# EAGLE design LightingUPS (EAGLE 7.5.0)
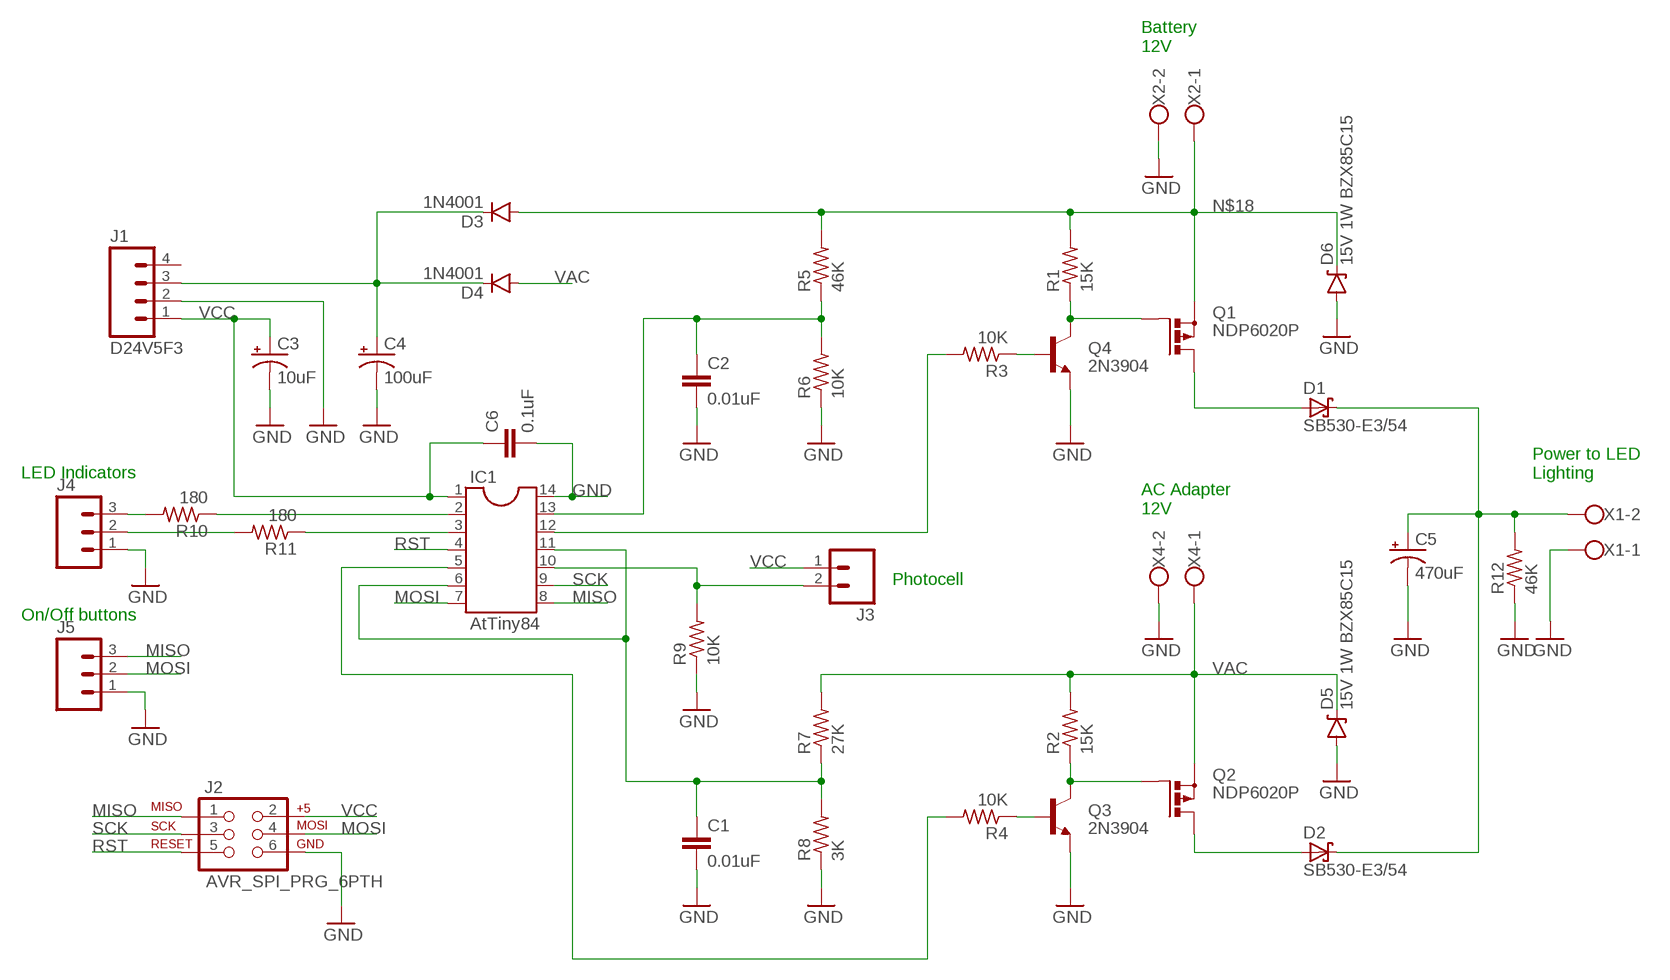
[diagram p0: schematic, sheet 1]

## Parts
C1  0.01uF  CAPPTH1  [CAP-PTH-5MM]
C2  0.01uF  CAPPTH1  [CAP-PTH-5MM]
C3  10uF  CAP_POLPTH1  [CPOL-RADIAL-100UF-25V]
C4  100uF  CAP_POLPTH1  [CPOL-RADIAL-100UF-25V]
C5  470uF  CAP_POLPTH4  [CPOL-RADIAL-1000UF-25V]
C6  0.1uF  CAPPTH  [CAP-PTH-SMALL]
D1  SB530-E3/54  SCHOTTKY-DIODEDO201T15  [DO201T15]
D2  SB530-E3/54  SCHOTTKY-DIODEDO201T15  [DO201T15]
D3  1N4001  DIODEPTH  [DIODE-1N4001]
D4  1N4001  DIODEPTH  [DIODE-1N4001]
D5  15V 1W BZX85C15  DIODE-ZENERPTH  [DIODE-ZENER]
D6  15V 1W BZX85C15  DIODE-ZENERPTH  [DIODE-ZENER]
IC1  AtTiny84  DIL14  [DIL14]
J1  D24V5F3  M04PTH  [1X04]
J2  AVR_SPI_PRG_6PTH  [2X3]
J3  M02PTH  [1X02]
J4  M03PTH  [1X03]
J5  M03PTH  [1X03]
Q1  NDP6020P  PMOSFET_PTO220BV  [TO220BV]
Q2  NDP6020P  PMOSFET_PTO220BV  [TO220BV]
Q3  2N3904  TRANSISTOR_NPNTO-92-AMMO  [TO-92-AMMO]
Q4  2N3904  TRANSISTOR_NPNTO-92-AMMO  [TO-92-AMMO]
R1  15K  R-US_0204/5  [0204/5]
R2  15K  R-US_0204/5  [0204/5]
R3  10K  R-US_0204/5  [0204/5]
R4  10K  R-US_0204/5  [0204/5]
R5  46K  R-US_0204/5  [0204/5]
R6  10K  R-US_0204/5  [0204/5]
R7  27K  R-US_0204/5  [0204/5]
R8  3K  R-US_0204/5  [0204/5]
R9  10K  R-US_0204/5  [0204/5]
R10  180  R-US_0204/5  [0204/5]
R11  180  R-US_0204/5  [0204/5]
R12  46K  R-US_0204/5  [0204/5]
X1  W237-102  [W237-102]
X2  W237-102  [W237-102]
X4  W237-102  [W237-102]

## Nets
GND: C1.2 C2.2 C3.2(-) C4.2(-) C5.- C6.2 D5.P$2(A) D6.P$2(A) IC1.14 J1.2 J2.6 J4.1 J5.1 Q3.1(E) Q4.1(E) R6.1 R8.1 R9.1 R12.1 X1.1 X2.2 X4.2
MISO: IC1.8 J2.1 J5.3
MOSI: IC1.7 J2.4 J5.2
N$1: J4.3 R10.2
N$2: Q1.G Q4.3(C) R1.1
N$3: Q4.2(B) R3.1
N$4: D1.A Q1.D
N$5: C5.+ D1.C D2.C R12.2 X1.2
N$6: C2.1 IC1.13 R5.1 R6.2
N$7: IC1.10 J3.2 R9.2
N$8: C1.1 IC1.6 IC1.11 R7.1 R8.2
N$9: Q2.G Q3.3(C) R2.1
N$10: Q3.2(B) R4.1
N$11: D2.A Q2.D
N$12: IC1.12 R3.2
N$13: C4.1(+) D3.C D4.C J1.3
N$14: IC1.5 R4.2
N$15: IC1.2 R10.1
N$16: IC1.3 R11.1
N$17: J4.2 R11.2
N$18: D3.A D6.P$1(C) Q1.S R1.2 R5.2 X2.1
RST: IC1.4 J2.5
SCK: IC1.9 J2.3
VAC: D4.A D5.P$1(C) Q2.S R2.2 R7.2 X4.1
VCC: C3.1(+) C6.1 IC1.1 J1.1 J2.2 J3.1
Unconnected: J1.4

## Notes on the sheet
- Battery
  12V
- LED Indicators
- Power to LED
  Lighting
- AC Adapter
  12V
- Photocell
- On/Off buttons

## Library data of the parts
C1 C2 = SparkFun-Passives:CAP: Capacitor Standard 0603 ceramic capacitor, and 0.1" leaded capacitor.
C3-C5 = SparkFun-Capacitors:CAP_POL: Capacitor Polarized These are standard SMD and PTH capacitors. Normally 10uF, 47uF, and 100uF in electrolytic and tantalum varieties. Always verify the external diameter of the through hole cap, it varies with capacity, voltage, and manufacturer. The EIA devices should be standard.
C6 = SparkFun-Capacitors:CAP: Capacitor Standard 0603 ceramic capacitor, and 0.1" leaded capacitor.
D1 D2 = adafruit:SCHOTTKY-DIODE: Schottky Diode
D3 D4 = SparkFun-DiscreteSemi:DIODE: Diode These are standard reverse protection diodes and small signal diodes. SMA package can handle up to about 1A. SOD-323 can handle about 200mA. What the SOD-323 package when ordering, there are some mfgs out there that are 5-pin packages.
D5 D6 = SparkFun-DiscreteSemi:DIODE-ZENER: Zener Diode Production Part - 8199 3.4V Zener Voltage
IC1 = ic-package:DIL14: Dual In Line / Socket
J1 = SparkFun-Connectors:M04: Header 4 Standard 4-pin 0.1" header. Use with straight break away headers (SKU : PRT-00116), right angle break away headers (PRT-00553), swiss pins (PRT-00743), machine pins (PRT-00117), and female headers (PRT-00115). Molex polarized connector foot print use with SKU : PRT-08231 with associated crimp pins and housings. 1MM SMD Version SKU: PRT-10208; PROD_ID: CONN-09696
J2 = SparkFun-Connectors:AVR_SPI_PRG_6: AVR ISP 6 Pin This is the reduced ISP connector for AVR programming. Common on Arduino. This footprint will take up less PCB space and can be used with a 10-pin to 6-pin adapter such as SKU: BOB-08508 **Special note about "TEST_POINT" package. The stop mask is on the top side, so if you want your programming test points to be on the bottom of your board, make sure to place this package on the bottom side of the board. This also ensure that the orientation to program from the bottom side will be correct.
J3 = SparkFun-Connectors:M02: Standard 2-pin 0.1" header. Use with - straight break away headers ( PRT-00116) - right angle break away headers (PRT-00553) - swiss pins (PRT-00743) - machine pins (PRT-00117) - female headers (PRT-00115) Molex polarized connector foot print use with: PRT-08233 with associated crimp pins and housings. 2.54_SCREWTERM for use with PRT-10571. 3.5mm Screw Terminal footprints for PRT-08084 5mm Screw Terminal footprints for use with PRT-08432
J4 J5 = SparkFun-Connectors:M03: Header 3 Standard 3-pin 0.1" header. Use with straight break away headers (SKU : PRT-00116), right angle break away headers (PRT-00553), swiss pins (PRT-00743), machine pins (PRT-00117), and female headers (PRT-00115). Molex polarized connector foot print use with SKU : PRT-08232 with associated crimp pins and housings.
Q1 Q2 = transistor-power:PMOSFET_P: Power MOSFET P-Channel
Q3 Q4 = SparkFun-DiscreteSemi:TRANSISTOR_NPN: Generic NPN BJT MMBT2222A - TRANS-08049 (SOT-23, 1A 40V) MPSA42 - TRANS-09116 (SOT-23, 500mA 300V) MMBT5088LT1G - TRANS-11160 (SOT-23, 50 mA 30V) BC547 - COM-08928 <http://www.sparkfun.com/products/8928> (TO-92 45V 100mA) (1.Collector 2.Base 3.Emitter) 2N3904 - COM-00521 <http://www.sparkfun.com/products/521> (TO-92 40V 200mA) (1.Emitter 2.Base 3.Collector) P2N2222A - COM-12852 <http://www.sparkfun.com/products/12852> (TO-92 40V 600mA) (1.Collector 2.Base 3.Emitter)
R1-R12 = resistor:R-US_: RESISTOR, American symbol
X1 X2 X4 = con-wago-500:W237-102: WAGO SCREW CLAMP; MPN: 237-102; OC_FARNELL: unknown; OC_NEWARK: 70K9898

## Board
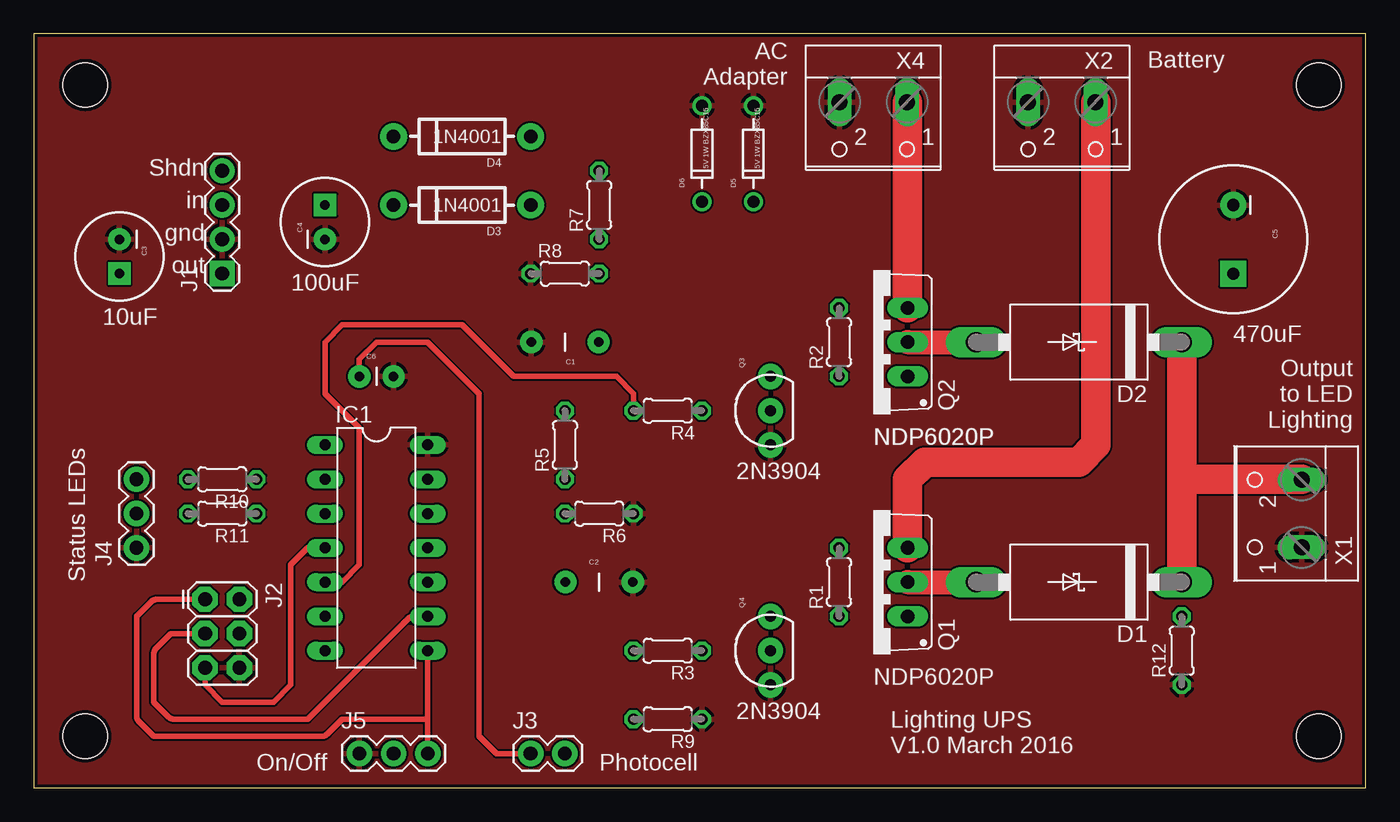
[diagram p1: board, top side]
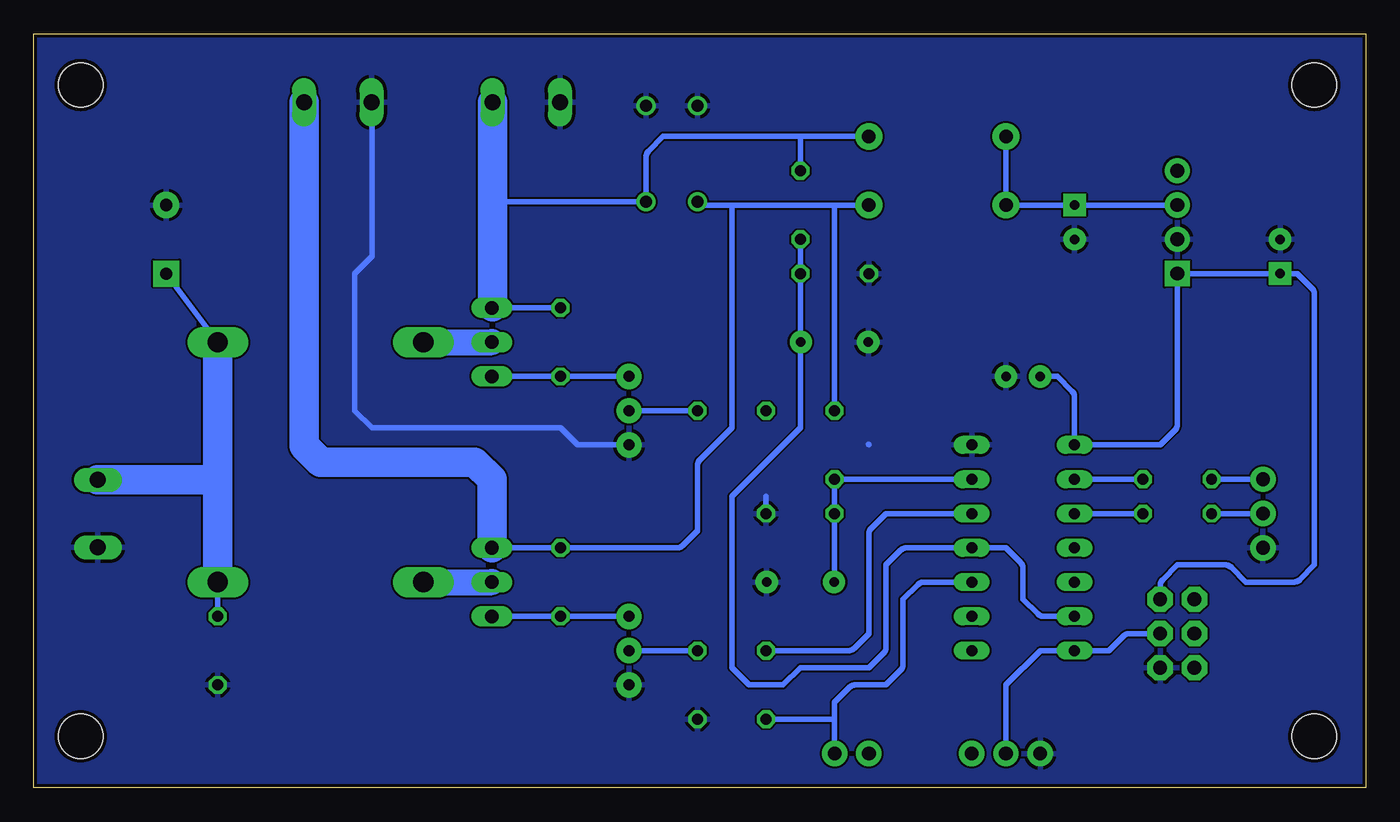
[diagram p2: board, bottom side, seen from below]

Size 98.73 x 55.87 mm. Coordinates in mm from the lower left corner, seen from the top.
Outline: 0,0 98.73,0 98.73,55.87 0,55.87 0,0
Copper layers (1*16): Top 0.035mm / dielectric 1.5mm / Bottom 0.035mm
Design rules "SeeedStudio_2layer_DRU_no_angle_20140221": minimum track width 6mil, minimum drill 12mil, track to track 6mil, track to pad 6mil, pad to pad 6mil, via to via 6mil, smd to smd 0mil, copper to edge 10mil, drill to drill 10mil, minimum pad ring 10mil, minimum via ring 6mil, stop-mask expansion 2mil, vias tented up to drill 100mil, thermal gap 10mil

### Footprints (pad centres in the part's own frame; a part is rotated, then mirrored left to right if it is on the bottom)
CAP-PTH-5MM = drill 0.7 pad 1.651: 1 -2.5,0; 2 2.5,0
CPOL-RADIAL-100UF-25V = drill 0.7 pad 1.651 square: 1 1.27,0 | drill 0.7 pad 1.651: 2 -1.27,0
CPOL-RADIAL-1000UF-25V = drill 0.9 pad 1.93 square: + 2.54,0 | drill 0.9 pad 1.93: - -2.54,0
CAP-PTH-SMALL = drill 0.7 pad 1.651: 1 0,0; 2 2.54,0
DO201T15 = drill 1.499 long: A 7.62,0; C -7.62,0
DIODE-1N4001 = drill 1 pad 1.981: A -5.08,0; C 5.08,0
DIODE-ZENER = drill 0.9: P$1 -3.556,0; P$2 3.556,0
DIL14 = drill 0.813 long: 1 -7.62,-3.81; 2 -5.08,-3.81; 3 -2.54,-3.81; 4 0,-3.81; 5 2.54,-3.81; 6 5.08,-3.81; 7 7.62,-3.81; 8 7.62,3.81; 9 5.08,3.81; 10 2.54,3.81; 11 0,3.81; 12 -2.54,3.81; 13 -5.08,3.81; 14 -7.62,3.81
1X04 = drill 1.016 pad 1.88 square: 1 0,0 | drill 1.016 pad 1.88: 2 2.54,0; 3 5.08,0; 4 7.62,0
2X3 = drill 1.016 pad 1.88 octagon: 1 0,0; 2 0,2.54; 3 2.54,0; 4 2.54,2.54; 5 5.08,0; 6 5.08,2.54
1X02 = drill 1.016 pad 1.88: 1 0,0; 2 2.54,0
1X03 = drill 1.016 pad 1.88: 1 0,0; 2 2.54,0; 3 5.08,0
TO220BV = drill 1.016 long: D 0,-2.54; G -2.54,-2.54; S 2.54,-2.54
TO-92-AMMO = drill 0.813 pad 1.88: 1 -2.54,0; 2 0,0; 3 2.54,0
0204/5 = drill 0.813 octagon: 1 -2.54,0; 2 2.54,0
STAND-OFF = hole 3.302: 0,0
W237-102 = drill 1.194 long: 1 -2.5,-1.27; 2 2.5,-1.27

### Placement (x,y rotation side)
C1  39.37,33.02 180 top
C2  41.91,15.24 0 top
C3  6.35,39.37 270 top
C4  21.59,41.91 90 top
C5  88.9,40.64 270 top
C6  24.13,30.48 0 top
D1  77.47,15.24 180 top
D2  77.47,33.02 180 top
D3  31.75,43.18 180 top
D4  31.75,48.26 180 top
D5  53.34,46.99 90 top
D6  49.53,46.99 90 top
IC1  25.4,17.78 270 top
J1  13.97,38.1 90 top
J2  12.7,13.97 270 top
J3  36.83,2.54 0 top
J4  7.62,17.78 90 top
J5  24.13,2.54 0 top
Q1  62.23,15.24 90 top
Q2  62.23,33.02 90 top
Q3  54.61,27.94 90 top
Q4  54.61,10.16 90 top
R1  59.69,15.24 90 top
R2  59.69,33.02 90 top
R3  46.99,10.16 180 top
R4  46.99,27.94 180 top
R5  39.37,25.4 90 top
R6  41.91,20.32 180 top
R7  41.91,43.18 90 top
R8  39.37,38.1 0 top
R9  46.99,5.08 180 top
R10  13.97,22.86 180 top
R11  13.97,20.32 180 top
R12  85.09,10.16 90 top
U$1  [STAND-OFF]  3.81,3.81 0 top
U$2  [STAND-OFF]  95.25,3.81 0 top
U$3  [STAND-OFF]  3.81,52.07 0 top
U$4  [STAND-OFF]  95.25,52.07 0 top
X1  92.71,20.32 90 top
X2  76.2,49.53 180 top
X4  62.23,49.53 180 top

### Tracks (layer width: path | path; a pad name or v marks a point on that pad's centre or on a via)
GND
  Bottom 0.406: C2.2 arc45 44.45,15.34 | 59.66,50.73 arc-45 59.21,50.55 arc45 59.66,50.73 | 59.66,50.73 X4.2 | 36.87,25.44 36.83,25.4 | 44.45,21.59 R6.1 | Q3.1 58.42,25.4 59.69,26.67 73.66,26.67 74.93,27.94 74.93,38.1 73.66,39.37 73.66,50.76 X2.2
  pour Bottom: 0,0 0,55.88 99.06,55.88 99.06,0
  pour Top: 0,0 0,55.88 99.06,55.88 99.06,0
MISO
  Top 0.406: IC1.8 29.21,5.08 | 29.21,5.08 J5.3 | J2.1 9.15,13.97 arc45 8.7,13.78 7.62,12.7 7.62,5.34 arc45 7.81,4.89 8.89,3.81 21.33,3.81 arc45 21.78,4 22.86,5.08 29.21,5.08
MOSI
  Bottom 0.406: J2.4 17.52,11.43 arc-45 17.97,11.24 19.05,10.16 IC1.7 24.13,10.16 26.67,7.62 J5.2
N$1
  Bottom 0.406: J4.3 R10.2
N$2
  Bottom 0.406: Q1.G R1.1 Q4.3
N$3
  Bottom 0.406: R3.1 Q4.2
N$4
  Top 1.778: Q1.D D1.A
  Bottom 1.93: D1.A Q1.D
N$5
  Top 2.184: D2.C 85.09,22.86 | 85.09,22.86 D1.C | 93.98,22.86 85.09,22.86
  Bottom 0.406: D2.C C5.+ | R12.2 D1.C
  Bottom 2.184: D2.C 85.09,22.86 | 85.09,22.86 D1.C | X1.2 85.13,22.82 85.09,22.86
N$6
  Bottom 0.406: IC1.13 R5.1 R6.2 39.37,15.34 arc45 C2.1
N$7
  Bottom 0.406: J3.2 39.37,5.08 | 39.37,5.08 R9.2 | IC1.10 32.76,15.24 arc-45 33.21,15.05 34.29,13.97 34.29,9.15 arc45 34.48,8.7 35.56,7.62 37.84,7.62 arc-45 38.29,7.43 39.37,6.35 39.37,5.08
N$8
  Bottom 0.406: R7.1 R8.2 41.91,33.12 arc-45 C1.1 arc-45 41.91,32.92 41.91,26.67 46.99,21.59 46.99,8.89 45.72,7.62 43.18,7.62 41.91,8.89 36.83,8.89 35.75,9.97 arc-45 35.56,10.42 35.56,16.51 34.48,17.59 arc45 34.03,17.78 IC1.11 26.67,17.78 25.59,16.7 arc45 25.4,16.25 25.4,13.97 24.32,12.89 arc-45 23.87,12.7 IC1.6
N$9
  Bottom 0.406: Q2.G R2.1 Q3.3
N$10
  Bottom 0.406: R4.1 Q3.2
N$11
  Top 1.778: Q2.D D2.A
  Bottom 1.93: D2.A Q2.D
N$12
  Bottom 0.406: R3.2 38.36,10.16 arc-45 37.91,10.35 36.83,11.43 36.83,18.79 arc45 36.64,19.24 35.56,20.32 IC1.12
N$13
  Bottom 0.406: J1.3 C4.1 D3.C D4.C
N$14
  Top 0.406: IC1.5 22.86,15.24 24.13,16.51 24.13,26.67 21.59,29.21 21.59,33.02 22.86,34.29 31.75,34.29 35.56,30.48 43.18,30.48 44.45,29.21 R4.2
N$15
  Bottom 0.406: IC1.2 R10.1
N$16
  Bottom 0.406: IC1.3 R11.1
N$17
  Bottom 0.406: J4.2 R11.2
N$18
  Top 2.184: 78.74,50.8 78.74,25.4 77.47,24.13 66.04,24.13 64.77,22.86 Q1.S
  Bottom 0.406: 39.37,43.18 46.99,43.18 | D3.A 39.37,43.18 | 39.37,43.18 R5.2 | Q1.S R1.2 51.06,17.78 arc-45 50.61,17.97 49.53,19.05 49.53,23.87 arc45 49.34,24.32 46.99,26.67 46.99,43.18 | 46.99,43.18 49.01,43.18 arc45 49.46,43.37 D6.P$1
  Bottom 2.184: X2.1 78.7,25.36 77.47,24.13 66.04,24.13 64.77,22.86 Q1.S
RST
  Top 0.406: IC1.4 20.32,17.78 19.05,16.51 19.05,7.62 17.78,6.35 13.97,6.35 12.7,7.62 J2.5
SCK
  Top 0.406: IC1.9 28.2,12.7 arc45 27.75,12.51 20.32,5.08 10.42,5.08 arc-45 9.97,5.27 8.89,6.35 8.89,9.9 arc-45 9.08,10.35 10.16,11.43 J2.3
VAC
  Top 2.184: 64.77,50.8 Q2.S
  Bottom 0.406: Q2.S R2.2 | 64.21,42.93 arc45 64.66,43.11 64.73,43.18 64.66,43.25 arc45 64.21,43.43 D5.P$1 53.34,46.73 arc45 53.15,47.18 52.07,48.26 41.91,48.26 | 41.91,48.26 D4.A | R7.2 41.91,48.26
  Bottom 1.93: 64.73,35.66 arc45 Q2.S
  Bottom 2.184: X4.1 64.73,43.18 64.73,35.66
VCC
  Top 0.406: J3.1 34.29,2.54 33.02,3.81 33.02,29.21 29.21,33.02 25.4,33.02 24.13,31.75 C6.1
  Bottom 0.406: C6.1 22.86,30.48 21.78,29.4 arc45 21.59,28.95 IC1.1 15.24,25.4 14.16,26.48 arc-45 13.97,26.93 J1.1 C3.1 5.08,38.1 4,37.02 arc45 3.81,36.57 3.81,16.51 4.89,15.43 arc45 5.34,15.24 8.89,15.24 9.97,16.32 arc-45 10.42,16.51 13.97,16.51 15.05,15.43 arc-45 15.24,14.98 J2.2

### Text on the board
tPlace: Battery | AC / Adapter | Shdn / in / gnd / out | 100uF | 10uF | 470uF | Output / to LED / Lighting | NDP6020P | NDP6020P | 2N3904 | Status LEDs | NDP6020P | 2N3904 | Lighting UPS / V1.0 March 2016 | On/Off | Photocell